# Altium schematic sheet TOPLEVEL.SchDoc: AC
size A4; Author: Nguyen Huu Nghia; CompanyName: MAT; Organization: AD20; Address1: x; Address2: x; Address3: x; Address4: x; DocumentNumber: 1; Revision: V1.0; SheetNumber: 1; SheetTotal: 1
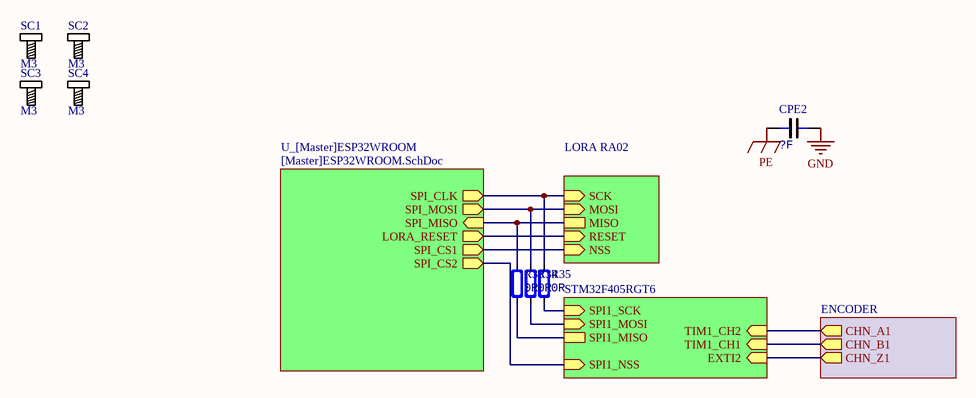
[diagram p0: TOPLEVEL.SchDoc]

## Parts
CPE2  value ?F  [CN3]  (hidden comment: Cap_PE)
R33  value 0R  [RES-1/4W]  (hidden comment: Resistor)
R34  value 0R  [RES-1/4W]  (hidden comment: Resistor)
R35  value 0R  [RES-1/4W]  (hidden comment: Resistor)
SC1  M3  [SCRREW_M3]
SC2  M3  [SCRREW_M3]
SC3  M3  [SCRREW_M3]
SC4  M3  [SCRREW_M3]

## Sub-sheets
ENCODER = [Module]ReadSingleEncoderABZ.SchDoc: CHN_A1 (out), CHN_B1 (out), CHN_Z1 (out)
LORA RA02 = [Slave]SX1278.SchDoc: NSS (in), SCK (in), MOSI (in), RESET (in), MISO
STM32F405RGT6 = [Slave]STM32F405RGT6.SchDoc: TIM1_CH2 (in), TIM1_CH1 (in), EXTI2 (in), SPI1_NSS (in), SPI1_SCK (in), SPI1_MOSI (in), SPI1_MISO
U_[Master]ESP32WROOM = [Master]ESP32WROOM.SchDoc: LORA_RESET (out), SPI_MOSI (out), SPI_CLK (out), SPI_MISO (in), SPI_CS2 (out), SPI_CS1 (out)

## Nets
GND: CPE2.2
PE: CPE2.1
NetR33_1: R33.1 ; sheet STM32F405RGT6/SPI1_MISO
NetR33_2: R33.2 ; sheet U_[Master]ESP32WROOM/SPI_MISO, sheet LORA RA02/MISO
NetR34_1: R34.1 ; sheet STM32F405RGT6/SPI1_MOSI
NetR34_2: R34.2 ; sheet U_[Master]ESP32WROOM/SPI_MOSI, sheet LORA RA02/MOSI
NetR35_1: R35.1 ; sheet STM32F405RGT6/SPI1_SCK
NetR35_2: R35.2 ; sheet U_[Master]ESP32WROOM/SPI_CLK, sheet LORA RA02/SCK
(unnamed): sheet U_[Master]ESP32WROOM/LORA_RESET, sheet LORA RA02/RESET
(unnamed): sheet U_[Master]ESP32WROOM/SPI_CS2, sheet STM32F405RGT6/SPI1_NSS
(unnamed): sheet U_[Master]ESP32WROOM/SPI_CS1, sheet LORA RA02/NSS
(unnamed): sheet STM32F405RGT6/TIM1_CH2, sheet ENCODER/CHN_A1
(unnamed): sheet STM32F405RGT6/TIM1_CH1, sheet ENCODER/CHN_B1
(unnamed): sheet STM32F405RGT6/EXTI2, sheet ENCODER/CHN_Z1

## Notes on the sheet
- Title
- Size:
- Date:
- A4
- Number:
- Time:
- Revision:
- Sheet
- of
- File:

## Library data of the parts
CPE2 = Cap_PE: Capacitor; Manufacturer: *; Note: *
R33-R35 = Resistor: SMD Resistor; Specification: ±1%; Manufacturer: *; Note: *
SC1-SC4 = Screw_M3: Screw